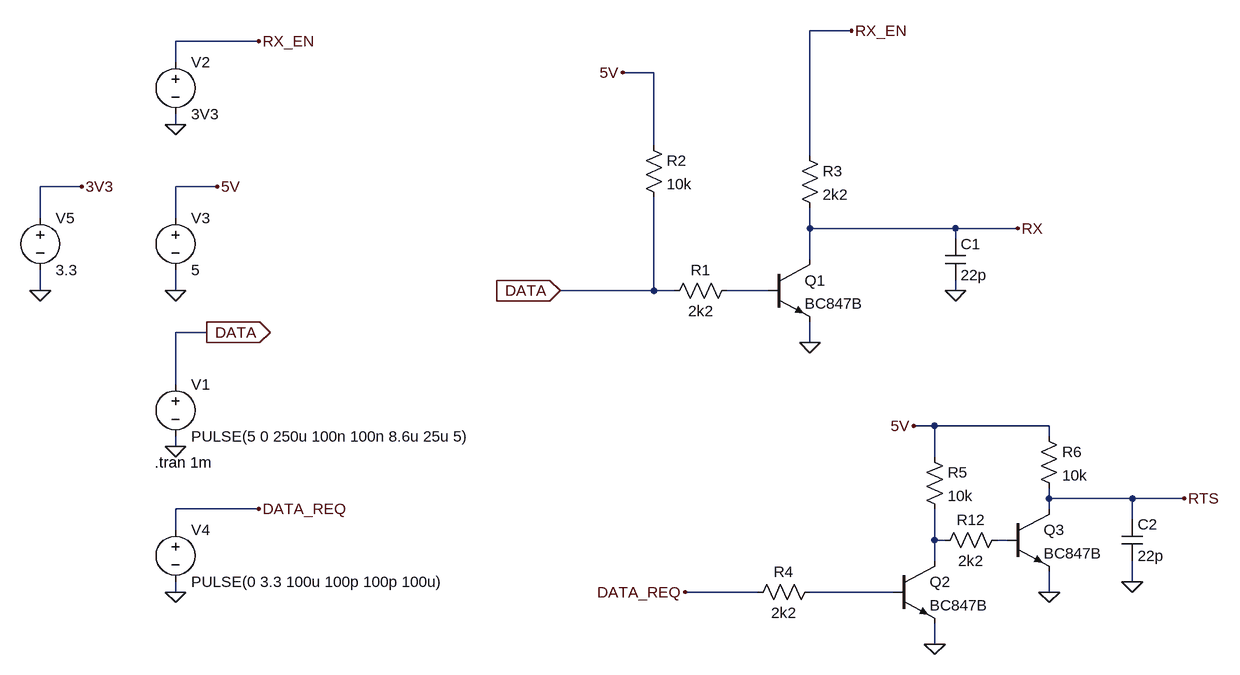
[diagram p0: schematic UART_invert.asc]
UART_invert.asc, the LTspice schematic file:
Version 4
SHEET 1 2080 1220
WIRE 464 -336 400 -336
WIRE -448 -320 -576 -320
WIRE -576 -288 -576 -320
WIRE 160 -272 112 -272
WIRE -576 -192 -576 -208
WIRE 160 -160 160 -272
WIRE 400 -144 400 -336
WIRE -720 -96 -784 -96
WIRE -512 -96 -576 -96
WIRE -784 -48 -784 -96
WIRE -576 -48 -576 -96
WIRE 400 -32 400 -64
WIRE 624 -32 400 -32
WIRE 720 -32 624 -32
WIRE 624 -16 624 -32
WIRE 400 16 400 -32
WIRE -784 64 -784 32
WIRE -576 64 -576 32
WIRE 160 64 160 -80
WIRE 160 64 16 64
WIRE 192 64 160 64
WIRE 336 64 272 64
WIRE 624 64 624 48
WIRE -528 128 -576 128
WIRE 400 144 400 112
WIRE -576 208 -576 128
WIRE 592 272 560 272
WIRE 768 272 592 272
WIRE 768 288 768 272
WIRE -576 304 -576 288
WIRE 592 320 592 272
WIRE 768 384 768 368
WIRE 896 384 768 384
WIRE 976 384 896 384
WIRE -448 400 -576 400
WIRE 768 400 768 384
WIRE 896 416 896 384
WIRE -576 432 -576 400
WIRE 592 448 592 400
WIRE 608 448 592 448
WIRE 704 448 688 448
WIRE 592 480 592 448
WIRE 896 512 896 480
WIRE -576 528 -576 512
WIRE 320 528 208 528
WIRE 528 528 400 528
WIRE 768 528 768 496
WIRE 592 608 592 576
FLAG -576 304 0
FLAG -576 64 0
FLAG 16 64 DATA
IOPIN 16 64 In
FLAG -528 128 DATA
IOPIN -528 128 Out
FLAG 400 144 0
FLAG -576 -192 0
FLAG 624 64 0
FLAG -512 -96 5V
FLAG 112 -272 5V
FLAG -448 -320 RX_EN
FLAG 464 -336 RX_EN
FLAG -576 528 0
FLAG -448 400 DATA_REQ
FLAG 592 608 0
FLAG 560 272 5V
FLAG 208 528 DATA_REQ
FLAG 976 384 RTS
FLAG 720 -32 RX
FLAG -784 64 0
FLAG -720 -96 3V3
FLAG 768 528 0
FLAG 896 512 0
SYMBOL voltage -576 192 R0
WINDOW 123 0 0 Left 0
WINDOW 39 0 0 Left 0
SYMATTR InstName V1
SYMATTR Value PULSE(5 0 250u 100n 100n 8.6u 25u 5)
SYMBOL voltage -576 -304 R0
WINDOW 123 0 0 Left 0
WINDOW 39 0 0 Left 0
SYMATTR InstName V2
SYMATTR Value 3V3
SYMBOL npn 336 16 R0
SYMATTR InstName Q1
SYMATTR Value BC847B
SYMBOL res 176 80 R270
WINDOW 0 32 56 VTop 2
WINDOW 3 0 56 VBottom 2
SYMATTR InstName R1
SYMATTR Value 2k2
SYMBOL res 144 -176 R0
SYMATTR InstName R2
SYMATTR Value 10k
SYMBOL res 384 -160 R0
SYMATTR InstName R3
SYMATTR Value 2k2
SYMBOL voltage -576 -64 R0
WINDOW 123 0 0 Left 0
WINDOW 39 0 0 Left 0
SYMATTR InstName V3
SYMATTR Value 5
SYMBOL cap 608 -16 R0
SYMATTR InstName C1
SYMATTR Value 22p
SYMBOL voltage -576 416 R0
WINDOW 123 0 0 Left 0
WINDOW 39 0 0 Left 0
SYMATTR InstName V4
SYMATTR Value PULSE(0 3.3 100u 100p 100p 100u)
SYMBOL npn 528 480 R0
SYMATTR InstName Q2
SYMATTR Value BC847B
SYMBOL res 304 544 R270
WINDOW 0 32 56 VTop 2
WINDOW 3 0 56 VBottom 2
SYMATTR InstName R4
SYMATTR Value 2k2
SYMBOL res 576 304 R0
SYMATTR InstName R5
SYMATTR Value 10k
SYMBOL voltage -784 -64 R0
WINDOW 123 0 0 Left 0
WINDOW 39 0 0 Left 0
SYMATTR InstName V5
SYMATTR Value 3.3
SYMBOL npn 704 400 R0
SYMATTR InstName Q3
SYMATTR Value BC847B
SYMBOL res 752 272 R0
SYMATTR InstName R6
SYMATTR Value 10k
SYMBOL cap 880 416 R0
SYMATTR InstName C2
SYMATTR Value 22p
SYMBOL res 592 464 R270
WINDOW 0 32 56 VTop 2
WINDOW 3 0 56 VBottom 2
SYMATTR InstName R12
SYMATTR Value 2k2
TEXT -608 328 Left 2 !.tran 1m

The netlist it stands for:
* UART_invert.asc
V1 DATA 0 PULSE(5 0 250u 100n 100n 8.6u 25u 5)
V2 RX_EN 0 3V3
Q1 RX N001 0 0 BC847B
R1 DATA N001 2k2
R2 5V DATA 10k
R3 RX_EN RX 2k2
V3 5V 0 5
C1 RX 0 22p
V4 DATA_REQ 0 PULSE(0 3.3 100u 100p 100p 100u)
Q2 N002 N004 0 0 BC847B
R4 DATA_REQ N004 2k2
R5 5V N002 10k
V5 3V3 0 3.3
Q3 RTS N003 0 0 BC847B
R6 5V RTS 10k
C2 RTS 0 22p
R12 N002 N003 2k2
.model NPN NPN
.model PNP PNP
.lib standard.bjt
.tran 1m
.backanno
.end